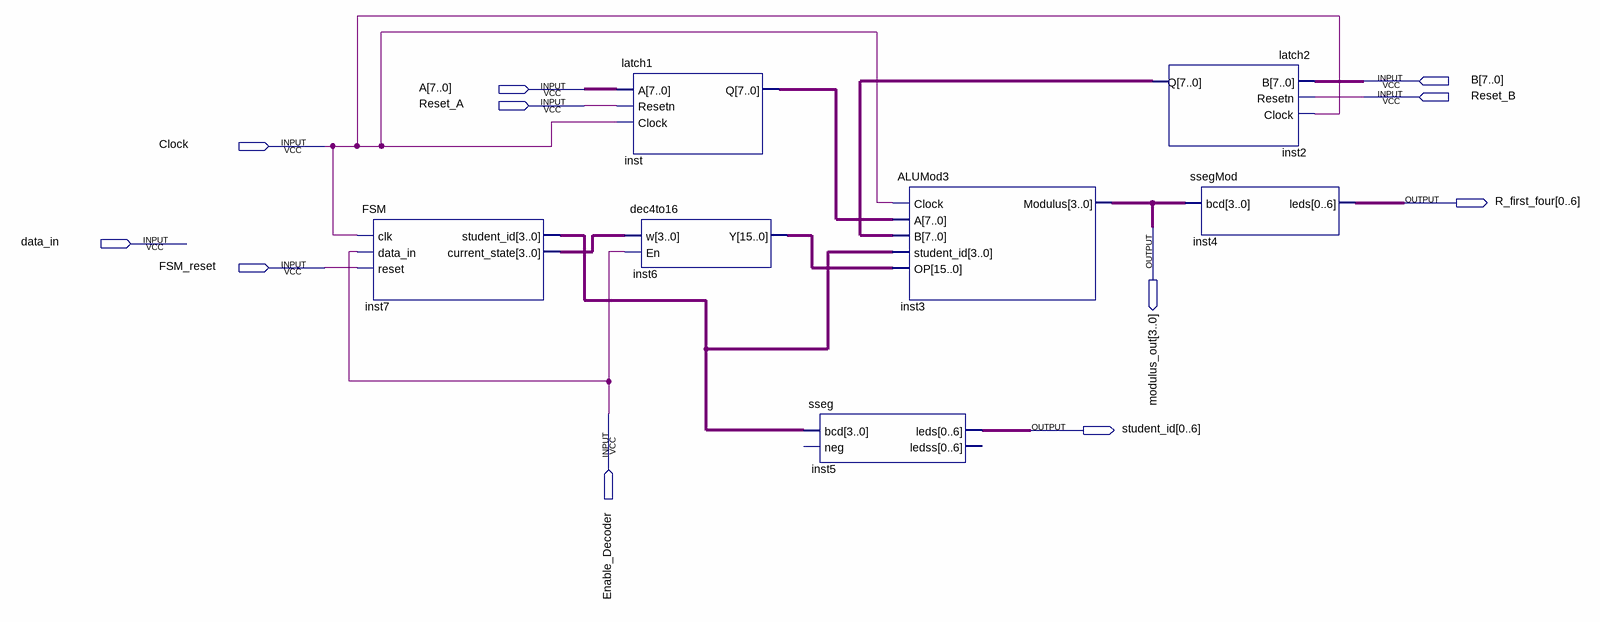
[diagram p0: schematic sheet]
// Quartus schematic Problem3.bdf as structural Verilog: 7 symbols, 11 pins
module Problem3 (
  input  [7:0] B,
  input  [7:0] A,
  input  Reset_B,
  input  Reset_A,
  input  Clock,
  input  data_in,
  input  FSM_reset,
  input  Enable_Decoder,
  output [0:6] R_first_four,
  output [3:0] modulus_out,
  output [0:6] student_id
);

  wire [3:0] inst7_current_state, inst7_student_id;
  wire [7:0] inst2_q, inst_q;
  wire [15:0] inst6_y;

  FSM inst7 (
    .clk(Clock), .data_in(Enable_Decoder), .reset(FSM_reset), .student_id(inst7_student_id),
    .current_state(inst7_current_state));
  latch1 inst (.A(A), .Resetn(Reset_A), .Clock(Clock), .Q(inst_q));
  dec4to16 inst6 (.w(inst7_current_state), .En(Enable_Decoder), .Y(inst6_y));
  sseg inst5 (.bcd(inst7_student_id), .leds(student_id));  // open: neg, ledss
  ALUMod3 inst3 (
    .Clock(Clock), .A(inst_q), .B(inst2_q), .student_id(inst7_student_id), .OP(inst6_y), .Modulus(modulus_out));
  latch2 inst2 (.B(B), .Resetn(Reset_B), .Clock(Clock), .Q(inst2_q));
  ssegMod inst4 (.bcd(modulus_out), .leds(R_first_four));
endmodule
